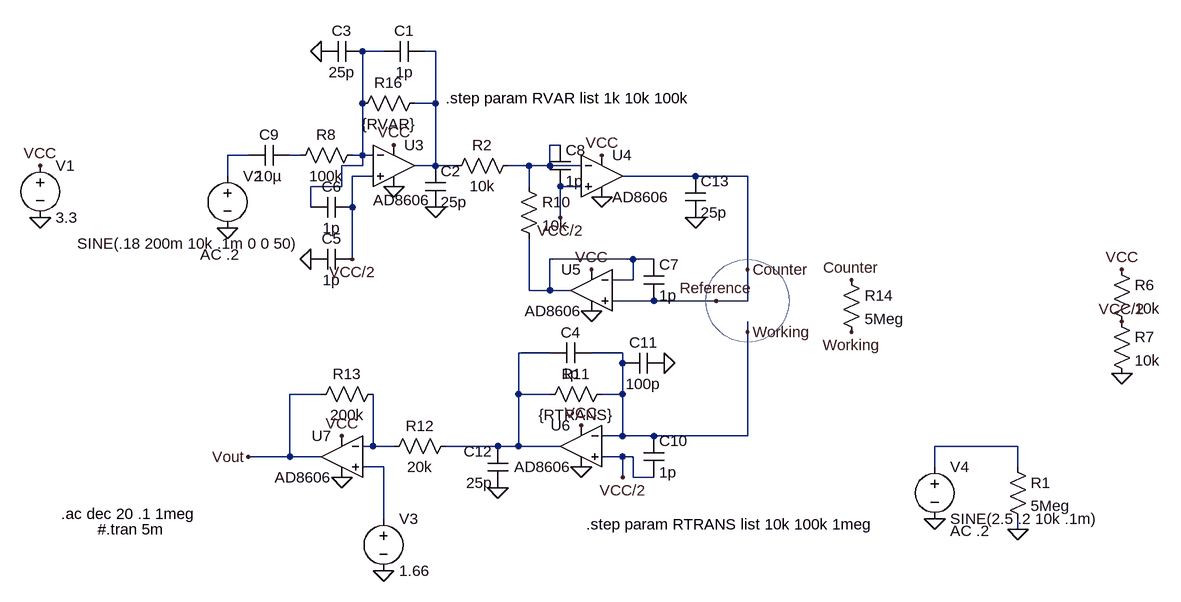
[diagram p0: schematic Analog Measurement.asc]
Analog Measurement.asc, the LTspice schematic file:
Version 4
SHEET 1 2260 1452
WIRE 1072 -208 1040 -208
WIRE 1152 -208 1136 -208
WIRE 1040 -128 1040 -208
WIRE 1152 -128 1152 -208
WIRE 1152 -128 1120 -128
WIRE 1344 -64 1328 -64
WIRE 864 -48 832 -48
WIRE 944 -48 928 -48
WIRE 1040 -48 1040 -128
WIRE 1040 -48 1024 -48
WIRE 1056 -48 1040 -48
WIRE 1040 -32 1040 -48
WIRE 1040 -32 1008 -32
WIRE 1152 -32 1152 -128
WIRE 1152 -32 1120 -32
WIRE 1184 -32 1152 -32
WIRE 1296 -32 1264 -32
WIRE 1328 -32 1328 -64
WIRE 1328 -32 1296 -32
WIRE 1376 -32 1328 -32
WIRE 832 -16 832 -48
WIRE 1056 -16 1024 -16
WIRE 1552 -16 1440 -16
WIRE 1632 -16 1552 -16
WIRE 1008 0 1008 -32
WIRE 1008 0 960 0
WIRE 1296 0 1296 -32
WIRE 1376 0 1344 0
WIRE 960 32 960 0
WIRE 1024 32 1024 -16
WIRE 1344 48 1344 0
WIRE 1024 112 1024 32
WIRE 1456 112 1328 112
WIRE 1488 112 1456 112
WIRE 1632 128 1632 -16
WIRE 1456 144 1456 112
WIRE 1456 144 1424 144
WIRE 1296 160 1296 80
WIRE 1328 160 1328 112
WIRE 1328 160 1296 160
WIRE 1360 160 1328 160
WIRE 1488 176 1424 176
WIRE 1584 176 1488 176
WIRE 1632 176 1632 128
WIRE 1632 176 1584 176
WIRE 1632 224 1632 208
WIRE 1328 256 1280 256
WIRE 1440 256 1392 256
WIRE 1440 272 1440 256
WIRE 976 320 928 320
WIRE 1280 320 1280 256
WIRE 1328 320 1280 320
WIRE 1440 320 1440 272
WIRE 1440 320 1408 320
WIRE 1440 384 1440 320
WIRE 1440 384 1408 384
WIRE 1488 384 1440 384
WIRE 1632 384 1632 224
WIRE 1632 384 1488 384
WIRE 1056 400 1056 320
WIRE 1056 400 1040 400
WIRE 1088 400 1056 400
WIRE 1248 400 1168 400
WIRE 1280 400 1280 320
WIRE 1280 400 1248 400
WIRE 1344 400 1280 400
WIRE 2048 400 1920 400
WIRE 928 416 928 320
WIRE 928 416 864 416
WIRE 976 416 928 416
WIRE 1440 416 1408 416
WIRE 1456 416 1440 416
WIRE 1072 432 1040 432
WIRE 1920 432 1920 400
WIRE 2048 432 2048 400
WIRE 1440 448 1440 416
WIRE 1456 448 1456 416
WIRE 1488 448 1456 448
WIRE 1072 512 1072 432
WIRE 2048 528 2048 512
FLAG 2208 288 0
FLAG 2208 128 VCC
FLAG 2208 208 VCC/2
FLAG 832 64 0
FLAG 1088 -64 VCC
FLAG 1088 0 0
FLAG 1344 48 VCC/2
FLAG 1408 16 0
FLAG 1408 -48 VCC
FLAG 1392 192 0
FLAG 1392 128 VCC
FLAG 1376 432 0
FLAG 1376 368 VCC
FLAG 1440 448 VCC/2
FLAG 1072 592 0
FLAG 1008 448 0
FLAG 1008 384 VCC
FLAG 1632 128 Counter
FLAG 1584 176 Reference
FLAG 1632 224 Working
FLAG 1792 224 Working
FLAG 1792 144 Counter
FLAG 1024 112 VCC/2
FLAG 864 416 Vout
FLAG 544 48 0
FLAG 544 -32 VCC
FLAG 1152 32 0
FLAG 976 -208 0
FLAG 960 112 0
FLAG 1504 272 0
FLAG 1248 464 0
FLAG 1552 48 0
FLAG 1920 512 0
FLAG 2048 528 0
SYMBOL res 2192 112 R0
SYMATTR InstName R6
SYMATTR Value 10k
SYMBOL res 2192 192 R0
SYMATTR InstName R7
SYMATTR Value 10k
SYMBOL voltage 832 -32 R0
WINDOW 123 -42 137 Left 2
WINDOW 39 0 0 Left 0
WINDOW 3 -231 120 Left 2
SYMATTR Value2 AC .2
SYMATTR Value SINE(.18 200m 10k .1m 0 0 50)
SYMATTR InstName V2
SYMBOL OpAmps\\AD8606 1088 -96 R0
WINDOW 3 -32 117 Left 2
SYMATTR InstName U3
SYMBOL OpAmps\\AD8606 1408 -80 R0
SYMATTR InstName U4
SYMBOL res 1280 -16 R0
SYMATTR InstName R10
SYMATTR Value 10k
SYMBOL OpAmps\\AD8606 1392 96 M0
SYMATTR InstName U5
SYMBOL OpAmps\\AD8606 1376 336 M0
SYMATTR InstName U6
SYMBOL res 1424 304 R90
WINDOW 0 0 56 VBottom 2
WINDOW 3 32 56 VTop 2
SYMATTR InstName R11
SYMATTR Value {RTRANS}
SYMBOL OpAmps\\AD8606 1008 352 M0
SYMATTR InstName U7
SYMBOL voltage 1072 496 R0
WINDOW 123 0 0 Left 0
WINDOW 39 0 0 Left 0
SYMATTR InstName V3
SYMATTR Value 1.66
SYMBOL res 1184 384 R90
WINDOW 0 0 56 VBottom 2
WINDOW 3 32 56 VTop 2
SYMATTR InstName R12
SYMATTR Value 20k
SYMBOL res 1072 304 R90
WINDOW 0 0 56 VBottom 2
WINDOW 3 32 56 VTop 2
SYMATTR InstName R13
SYMATTR Value 200k
SYMBOL res 1776 128 R0
SYMATTR InstName R14
SYMATTR Value 5Meg
SYMBOL res 1040 -64 R90
WINDOW 0 0 56 VBottom 2
WINDOW 3 32 56 VTop 2
SYMATTR InstName R8
SYMATTR Value 100k
SYMBOL res 1136 -144 R90
WINDOW 0 0 56 VBottom 2
WINDOW 3 32 56 VTop 2
SYMATTR InstName R16
SYMATTR Value {RVAR}
SYMBOL cap 928 -64 R90
WINDOW 0 0 32 VBottom 2
WINDOW 3 32 32 VTop 2
SYMATTR InstName C9
SYMATTR Value 10µ
SYMBOL res 1280 -48 R90
WINDOW 0 0 56 VBottom 2
WINDOW 3 32 56 VTop 2
SYMATTR InstName R2
SYMATTR Value 10k
SYMBOL cap 1392 240 R90
WINDOW 0 0 32 VBottom 2
WINDOW 3 32 32 VTop 2
SYMATTR InstName C4
SYMATTR Value 1p
SYMBOL voltage 544 -48 R0
WINDOW 123 0 0 Left 0
WINDOW 39 0 0 Left 0
SYMATTR InstName V1
SYMATTR Value 3.3
SYMBOL cap 1136 -224 R90
WINDOW 0 0 32 VBottom 2
WINDOW 3 32 32 VTop 2
SYMATTR InstName C1
SYMATTR Value 1p
SYMBOL cap 1136 -32 R0
SYMATTR InstName C2
SYMATTR Value 25p
SYMBOL cap 1040 -224 R90
WINDOW 0 0 32 VBottom 2
WINDOW 3 32 32 VTop 2
SYMATTR InstName C3
SYMATTR Value 25p
SYMBOL cap 1024 96 R90
WINDOW 0 0 32 VBottom 2
WINDOW 3 32 32 VTop 2
SYMATTR InstName C5
SYMATTR Value 1p
SYMBOL cap 1024 16 R90
WINDOW 0 0 32 VBottom 2
WINDOW 3 32 32 VTop 2
SYMATTR InstName C6
SYMATTR Value 1p
SYMBOL cap 1472 112 R0
SYMATTR InstName C7
SYMATTR Value 1p
SYMBOL cap 1328 -64 R0
SYMATTR InstName C8
SYMATTR Value 1p
SYMBOL cap 1472 384 R0
SYMATTR InstName C10
SYMATTR Value 1p
SYMBOL cap 1504 256 R90
WINDOW 0 0 32 VBottom 2
WINDOW 3 32 32 VTop 2
SYMATTR InstName C11
SYMATTR Value 100p
SYMBOL cap 1264 464 R180
WINDOW 0 24 56 Left 2
WINDOW 3 24 8 Left 2
SYMATTR InstName C12
SYMATTR Value 25p
SYMBOL cap 1536 -16 R0
SYMATTR InstName C13
SYMATTR Value 25p
SYMBOL voltage 1920 416 R0
WINDOW 123 24 114 Left 2
WINDOW 39 0 0 Left 0
SYMATTR Value2 AC .2
SYMATTR InstName V4
SYMATTR Value SINE(2.5 .2 10k .1m)
SYMBOL res 2032 416 R0
SYMATTR InstName R1
SYMATTR Value 5Meg
TEXT 576 504 Left 2 !.ac dec 20 .1 1meg
TEXT 632 528 Left 2 !#.tran 5m
TEXT 1168 -136 Left 2 !.step param RVAR list 1k 10k 100k
TEXT 1384 520 Left 2 !.step param RTRANS list 10k 100k 1meg
CIRCLE Normal 1568 240 1696 112 2

The netlist it stands for:
* Analog Measurement.asc
R6 VCC VCC/2 10k
R7 VCC/2 0 10k
V2 N004 0 SINE(.18 200m 10k .1m 0 0 50) AC .2
XU3 VCC/2 N001 VCC 0 N002 AD8606  ; pins In+ In- V+ V- OUT
XU4 VCC/2 N003 VCC 0 Reference AD8606  ; pins In+ In- V+ V- OUT
R10 N003 N006 10k
XU5 Reference N006 VCC 0 N006 AD8606  ; pins In+ In- V+ V- OUT
XU6 VCC/2 Working VCC 0 N007 AD8606  ; pins In+ In- V+ V- OUT
R11 Working N007 {RTRANS}
XU7 N010 N008 VCC 0 Vout AD8606  ; pins In+ In- V+ V- OUT
V3 N010 0 1.66
R12 N007 N008 20k
R13 N008 Vout 200k
R14 Reference Working 5Meg
R8 N001 N005 100k
R16 N002 N001 {RVAR}
C9 N005 N004 10µ
R2 N003 N002 10k
C4 Working N007 1p
V1 VCC 0 3.3
C1 N002 N001 1p
C2 N002 0 25p
C3 N001 0 25p
C5 VCC/2 0 1p
C6 VCC/2 N001 1p
C7 N006 Reference 1p
C8 N003 VCC/2 1p
C10 Working VCC/2 1p
C11 0 Working 100p
C12 0 N007 25p
C13 Reference 0 25p
V4 N009 0 SINE(2.5 .2 10k .1m) AC .2
R1 N009 0 5Meg
.ac dec 20 .1 1meg
#.tran 5m
.step param RVAR list 1k 10k 100k
.step param RTRANS list 10k 100k 1meg
.lib ADI.lib
.backanno
.end